# Altium schematic sheet 14.SchDoc
size 297 x 209 mm
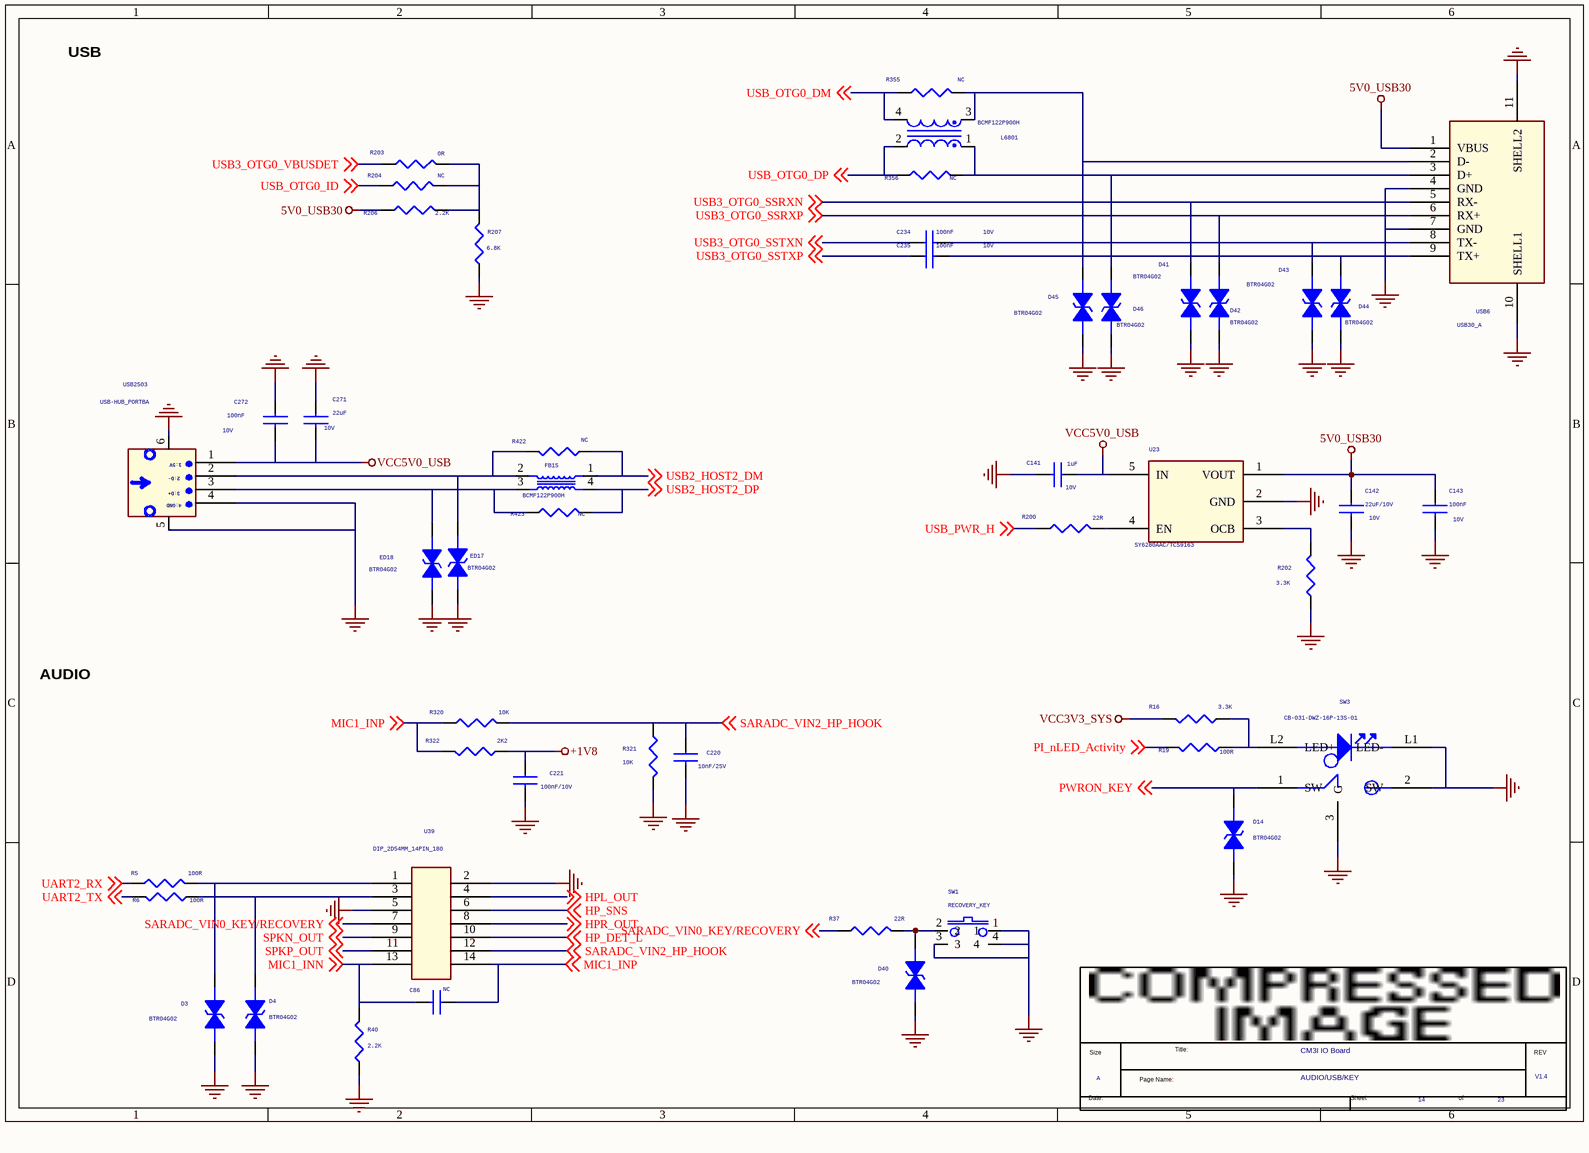
[diagram p0: 14.SchDoc]

## Parts
*  Page Count: 23  Page Number: 14  Page Size: A  Title: CM3I IO Board  RevCode: V1.4  Doc: AUDIO/USB/KEY  (hidden comment: radxa_1010)  (graphical)
C86  NC  [C0402]
C141  1uF  Voltage: 10V  [C0402]
C142  22uF/10V  Voltage: 10V  [C0603]
C143  100nF  Voltage: 10V  [C0402]
C220  10nF/25V  [C0402]
C221  100nF/10V  [C0402]
C234  100nF  Voltage: 10V  [C0402]
C235  100nF  Voltage: 10V  [C0402]
C271  22uF  Voltage: 10V  [C0603]
C272  100nF  Voltage: 10V  [C0402]
D3  BTR04G02  [ESD0402_1xD5]
D4  BTR04G02  [ESD0402_1xD5]
D14  BTR04G02  [ESD0402_1xD5]
D40  BTR04G02  [ESD0402_1xD5]
D41  BTR04G02  [ESD0402_1xD5]
D42  BTR04G02  [ESD0402_1xD5]
D43  BTR04G02  [ESD0402_1xD5]
D44  BTR04G02  [ESD0402_1xD5]
D45  BTR04G02  [ESD0402_1xD5]
D46  BTR04G02  [ESD0402_1xD5]
ED17  BTR04G02  [ESD0402_1xD5]
ED18  BTR04G02  [ESD0402_1xD5]
FB15  BCMF122P900H  [GMDG-4PIN_ESD]
L6801  BCMF122P900H  [L0402D]
R5  100R  [R0402]
R6  100R  [R0402]
R16  3.3K  [R0402]
R19  100R  [R0402]
R37  22R  [R0402]
R40  2.2K  [R0402]
R200  22R  [R0402]
R202  3.3K  [R0402]
R203  0R  [R0402]
R204  NC  [R0402]
R206  2.2K  [R0402]
R207  6.8K  [R0603]
R320  10K  [R0402]
R321  10K  [R0402]
R322  2K2  [R0402]
R355  NC  [R0402]
R356  NC  [R0402]
R422  NC  [R0402]
R423  NC  [R0402]
SW1  RECOVERY_KEY  [SW_4_DIP]
SW3  CB-031-DWZ-16P-13S-01  [DIP_SWITCH]
U23  SY6280AAC/TCS9163  [SOT_23_5]
U39  DIP_2D54MM_14PIN_180  [DIP_14PIN-2_54MM]
USB6  USB30_A  [USB30]
USB2503  USB-HUB_PORTBA  [USB20]

## Nets
5V0_USB30: C142.1 C143.1 R206.2 U23.1(VOUT) USB6.1(VBUS)
+1V8: C221.1 R322.2
GND: C141.2 C142.2 C143.2 C220.2 C221.2 C271.1 C272.1 D3.1 D4.1 D14.1 D40.1 D41.1 D42.1 D43.1 D44.1 D45.1 D46.1 ED17.2 ED18.2 R40.1 R202.2 R207.2 R321.1 SW1.1 SW1.3 SW1.4 SW3.2(SW) SW3.3(G) SW3.L1(LED-) U23.2(GND) U39.2 U39.5 USB6.4(GND) USB6.7(GND) USB6.10(SHELL1) USB6.11(SHELL2) USB2503.4 USB2503.5 USB2503.6
VCC3V3_SYS: R16.1
VCC5V0_USB: C141.1 C271.2 C272.2 U23.5(IN) USB2503.1
HP_DET_L: U39.10 ; off-sheet HP_DET_L
HP_SNS: U39.6 ; off-sheet HP_SNS
HPL_OUT: U39.4 ; off-sheet HPL_OUT
HPR_OUT: U39.8 ; off-sheet HPR_OUT
MIC1_INN: C86.2 R40.2 U39.13 ; off-sheet MIC1_INN
MIC1_INP: C86.1 R320.2 R322.1 U39.14 ; off-sheet MIC1_INP
PI_nLED_Activity: R19.2 ; off-sheet PI_nLED_Activity
PWRON_KEY: D14.2 SW3.1(SW) ; off-sheet PWRON_KEY
SARADC_VIN0_KEY/RECOVERY: R37.1 U39.7 ; off-sheet SARADC_VIN0_KEY/RECOVERY
SARADC_VIN2_HP_HOOK: C220.1 R320.1 R321.2 U39.12 ; off-sheet SARADC_VIN2_HP_HOOK
SPKN_OUT: U39.9 ; off-sheet SPKN_OUT
SPKP_OUT: U39.11 ; off-sheet SPKP_OUT
UART2_RX: R5.1 ; off-sheet UART2_RX
UART2_TX: R6.1 ; off-sheet UART2_TX
USB2_HOST2_DM: FB15.1(R1) R422.1 ; off-sheet USB2_HOST2_DM
USB2_HOST2_DP: FB15.4(R2) R423.1 ; off-sheet USB2_HOST2_DP
USB3_OTG0_SSRXN: D41.2 USB6.5(RX-) ; off-sheet USB3_OTG0_SSRXN
USB3_OTG0_SSRXP: D42.2 USB6.6(RX+) ; off-sheet USB3_OTG0_SSRXP
USB3_OTG0_SSTXN: C234.1 ; off-sheet USB3_OTG0_SSTXN
USB3_OTG0_SSTXP: C235.1 ; off-sheet USB3_OTG0_SSTXP
USB3_OTG0_VBUSDET: R203.2 ; off-sheet USB3_OTG0_VBUSDET
USB_OTG0_DM: L6801.4 R355.2 ; off-sheet USB_OTG0_DM
USB_OTG0_DP: L6801.2 R356.2 ; off-sheet USB_OTG0_DP
USB_OTG0_ID: R204.2 ; off-sheet USB_OTG0_ID
USB_PWR_H: R200.2 ; off-sheet USB_PWR_H
NetC234_2: C234.2 D43.2 USB6.8(TX-)
NetC235_2: C235.2 D44.2 USB6.9(TX+)
NetD3_2: D3.2 R5.2 U39.1
NetD4_2: D4.2 R6.2 U39.3
NetD40_2: D40.2 R37.2 SW1.2
NetD45_2: D45.2 L6801.3 R355.1 USB6.2(D-)
NetD46_2: D46.2 L6801.1 R356.1 USB6.3(D+)
NetED17_1: ED17.1 FB15.2(R4) R422.2 USB2503.2
NetED18_1: ED18.1 FB15.3(R3) R423.2 USB2503.3
NetR16_2: R16.2 R19.1 SW3.L2(LED+)
NetR200_1: R200.1 U23.4(EN)
NetR202_1: R202.1 U23.3(OCB)
NetR203_1: R203.1 R204.1 R206.1 R207.1

## Notes on the sheet
- USB
- AUDIO
- (in symbol radxa_1010) Title:; Size; REV; Page Name:; Date:; Sheet; of
- (in symbol USB20_TYPE_A) 1:5V; 2:D-; 3:D+; 4:GND

## Library data of the parts
C86 = CAP NP_0: cap,12.00pF,+/-5%,50V,C0G,C0402; Manufacturer: TDK; RK PN: C1005C0G1H120J050BA; Priority: A; Tolerance: 5%; Voltage: 50V; Dielectric: C0G; Part Type: C0402; Manufacturer PN: C1005C0G1H120J050BA; Created by: JJJ
C141 = CAP NP_0: cap,1.00uF,+/-10%,10V,X5R,C0402; Manufacturer PN: C1005X5R1A105K050BB; Manufacturer: TDK; Tolerance: 10%; C_Voltage: 6.3V; Priority: A; Dielectric: X5R; Created by: JJJ; Part Type: C0402; RK PN: C1005X5R1A105K050BB
C142 C143 = CAP NP_0: cap,100.00nF,+/-10%,10V,X5R,C0402; Manufacturer PN: C1005X5R1A104K050BA; Manufacturer: TDK; Tolerance: 10%; Priority: A; Dielectric: X5R; Created by: JJJ; Part Type: C0402; RK PN: C1005X5R1A104K050BA
C220 = CAP_Dup1: RoHS CHIP CAP 0.01uF +10/-10% X7R
C221 = CAP_Dup1: RoHS CHIP CAP 0.1uF +10/-10% X7R
C234 = CAP NP_0: cap,100.00nF,+/-10%,10V,X5R,C0201; Manufacturer PN: C0603X5R1A104K030BC; Manufacturer: TDK; Tolerance: 10%; Priority: A; Dielectric: X5R; Created by: JJJ; Part Type: C0201; RK PN: C0603X5R1A104K030BC
C235 = CAP NP_0: cap,100.00nF,+/-10%,10V,X5R,C0201; Manufacturer: TDK; RK PN: C0603X5R1A104K030BC; Priority: A; Tolerance: 10%; Dielectric: X5R; Part Type: C0201; Manufacturer PN: C0603X5R1A104K030BC; Created by: JJJ
C271 = CAP NP_0_Dup2: cap,10.00uF,+/-10%,10V,X5R,C0805; Manufacturer PN: C2012X5R1A106K125AB; Manufacturer: TDK; Tolerance: 10%; Priority: A; Dielectric: X5R; Created by: JJJ; Part Type: C0805; RK PN: C2012X5R1A106K125AB
C272 = CAP NP_3: cap,100.00nF,+/-10%,10V,X5R,C0402; Manufacturer PN: C1005X5R1A104K050BA; Manufacturer: TDK; C_Voltage: 6.3V; Tolerance: 10%; Priority: A; Number: 37; Dielectric: X5R; Created by: JJJ; Part Type: C0402; RK PN: C1005X5R1A104K050BA
D3 D42 = DIODE BI_DIR TRIG_0: 1-Line, Bi-directional, Transient Voltage Suppressors.17.5pF.; Manufacturer: WillSemi(韦尔半导体); RK PN: ESD5451N; Priority: A; OPTION: DNP; Part Type: ESD_TVS; Manufacturer PN: ESD5451N; Created by: JJJ
D4 D14 D40 D41 D43-D46 = DIODE BI_DIR TRIG_0: 1-Line, Bi-directional, Transient Voltage Suppressors.17.5pF.; Manufacturer PN: ESD5451N; Manufacturer: WillSemi(韦尔半导体); OPTION: DNP; Priority: A; Created by: JJJ; Part Type: ESD_TVS; RK PN: ESD5451N
ED17 = DIODE BI_DIR TRIG_0: 1-Line, Bi-directional, Transient Voltage Suppressors.17.5pF.; Manufacturer: WillSemi(韦尔半导体); RK PN: ESD5451N; Priority: A; Part Type: ESD_TVS; Manufacturer PN: ESD5451N; Created by: JJJ
ED18 = DIODE BI_DIR TRIG_0: 1-Line, Bi-directional, Transient Voltage Suppressors.17.5pF.; Manufacturer PN: ESD5451N; Manufacturer: WillSemi(韦尔半导体); Priority: A; Created by: JJJ; Part Type: ESD_TVS; RK PN: ESD5451N
FB15 = R-PACK4_3
L6801 = INDUCTOR COM: Winding Type Common Mode Choke Coil; Manufacturer: sunlord; RK PN: SDCW2012-2-900TF; Priority: A; DC Resistor: 0.35ohm; Tolerance: 25%; Irms: 330mA; Resonace frequency: 90R@100M; Part Type: IND; Manufacturer PN: SDCW2012-2-900TF; Created by: JJJ
R5 = RESISTOR_2: 通用厚膜电阻,22R,+/-5%,R0402,1/16W.; Manufacturer: YAGEO; Tolerance: 5%; RK PN: RC0402JR-0722RL; Priority: A; Wattage: 1/16W; Part Type: 通用厚膜电阻; Manufacturer PN: RC0402JR-0722RL; Created by: YTL
R6 R40 = RESISTOR_2: 通用厚膜电阻,22R,+/-5%,R0402,1/16W.; Manufacturer PN: RC0402JR-0722RL; Manufacturer: YAGEO; Tolerance: 5%; Wattage: 1/16W; Priority: A; Created by: YTL; Part Type: 通用厚膜电阻; RK PN: RC0402JR-0722RL
R16 R19 = RESISTOR_2_Dup1: 通用厚膜电阻,330R,+/-5%,R0402,1/16W.; Manufacturer PN: RC0402JR-07330RL; Manufacturer: YAGEO; Tolerance: 5%; Wattage: 1/16W; Priority: A; Created by: YTL; Part Type: 通用厚膜电阻; RK PN: RC0402JR-07330RL
R37 = RESISTOR_0_Dup1: 通用厚膜电阻,10K,+/-5%,R0402,1/16W.; Manufacturer: YAGEO; Tolerance: 5%; RK PN: RC0402JR-0710KL; Priority: A; Wattage: 1/16W; option: DNP; Part Type: 通用厚膜电阻; Manufacturer PN: RC0402JR-0710KL; Created by: YTL
R200 R204 = RESISTOR_0_Dup1: 通用厚膜电阻,0R,+/-5%,R0402,1/16W.; Manufacturer: YAGEO; Tolerance: 5%; RK PN: RC0402JR-070RL; Priority: A; Wattage: 1/16W; Part Type: 通用厚膜电阻; Manufacturer PN: RC0402JR-070RL; Created by: YTL
R202 = RESISTOR_0_Dup1: 通用厚膜电阻,4K7,+/-5%,R0402,1/16W.; Manufacturer PN: RC0402JR-074K7L; Manufacturer: YAGEO; Tolerance: 5%; Wattage: 1/16W; Priority: A; Created by: YTL; Part Type: 通用厚膜电阻; RK PN: RC0402JR-074K7L
R203 R206 = RESISTOR_0_Dup1: 通用厚膜电阻,0R,+/-5%,R0402,1/16W.; Manufacturer PN: RC0402JR-070RL; Manufacturer: YAGEO; Tolerance: 5%; Wattage: 1/16W; Priority: A; Created by: YTL; Part Type: 通用厚膜电阻; RK PN: RC0402JR-070RL
R207 = RES_0603
R320 R321 = RESISTOR_Dup2: ROHS CHIP RES 0R 1/16W 5%
R322 = RESISTOR_Dup2: ROHS CHIP RES 2K2 1/16W 5%
R355 = RESISTOR_0_Dup1: 通用厚膜电阻,4K7,+/-1%,R0402,1/16W.; Manufacturer PN: RC0402FR-074K7L; Manufacturer: YAGEO; Tolerance: 1%; Wattage: 1/16W; Priority: A; Created by: YTL; Part Type: 通用厚膜电阻; RK PN: RC0402FR-074K7L
R356 = RESISTOR_0_Dup1: 通用厚膜电阻,4K7,+/-1%,R0402,1/16W.; Manufacturer: YAGEO; Tolerance: 1%; RK PN: RC0402FR-074K7L; Priority: A; Wattage: 1/16W; Part Type: 通用厚膜电阻; Manufacturer PN: RC0402FR-074K7L; Created by: YTL
R422 R423 = RESISTOR_0_Dup3: 通用厚膜电阻,2R2,+/-5%,R0402,1/16W.; Manufacturer PN: RC0402JR-072R2L; Manufacturer: YAGEO; Tolerance: 5%; Wattage: 1/16W; Priority: A; Created by: YTL; Part Type: 通用厚膜电阻; RK PN: RC0402JR-072R2L
SW1 = KEY_0: Priority: A; Created by: YWQ; Part Type: KEY
SW3 = LED_0: 贴片LED灯，0603，绿色; Priority: A; RK PN: LED_GREEN; Created by: JJJ; Part Type: LED
U23 = SWITCH_SY6280: Low Loss Power Distribution Switch; Manufacturer: Silergy（矽力杰）; Priority: A; RK PN: SY6280AAC; Part Type: Switch; Manufacturer PN: SY6280AAC; Created by: JJJ
U39 = CON3_0
USB6 = USB30_TYPE_A: A型USB3.0座，卧式，插焊; Manufacturer: 旺科达; Priority: A; RK PN: USB-HOST_30; Created by: JJJ; Manufacturer Part Number: USB30_A; Part Type: USB Jack
USB2503 = USB20_TYPE_A: A型USB2.0座，卧式，插焊; Manufacturer: 旺科达; Priority: A; RK PN: USB-HOST_2.0; Created by: JJJ; Manufacturer Part Number: USB-HUB_PORTBA; Part Type: USB Jack
* = radxa_1010: Page Create Date: March  8, 1995